# EAGLE design o_clone_rev_f (EAGLE 9.6.0)
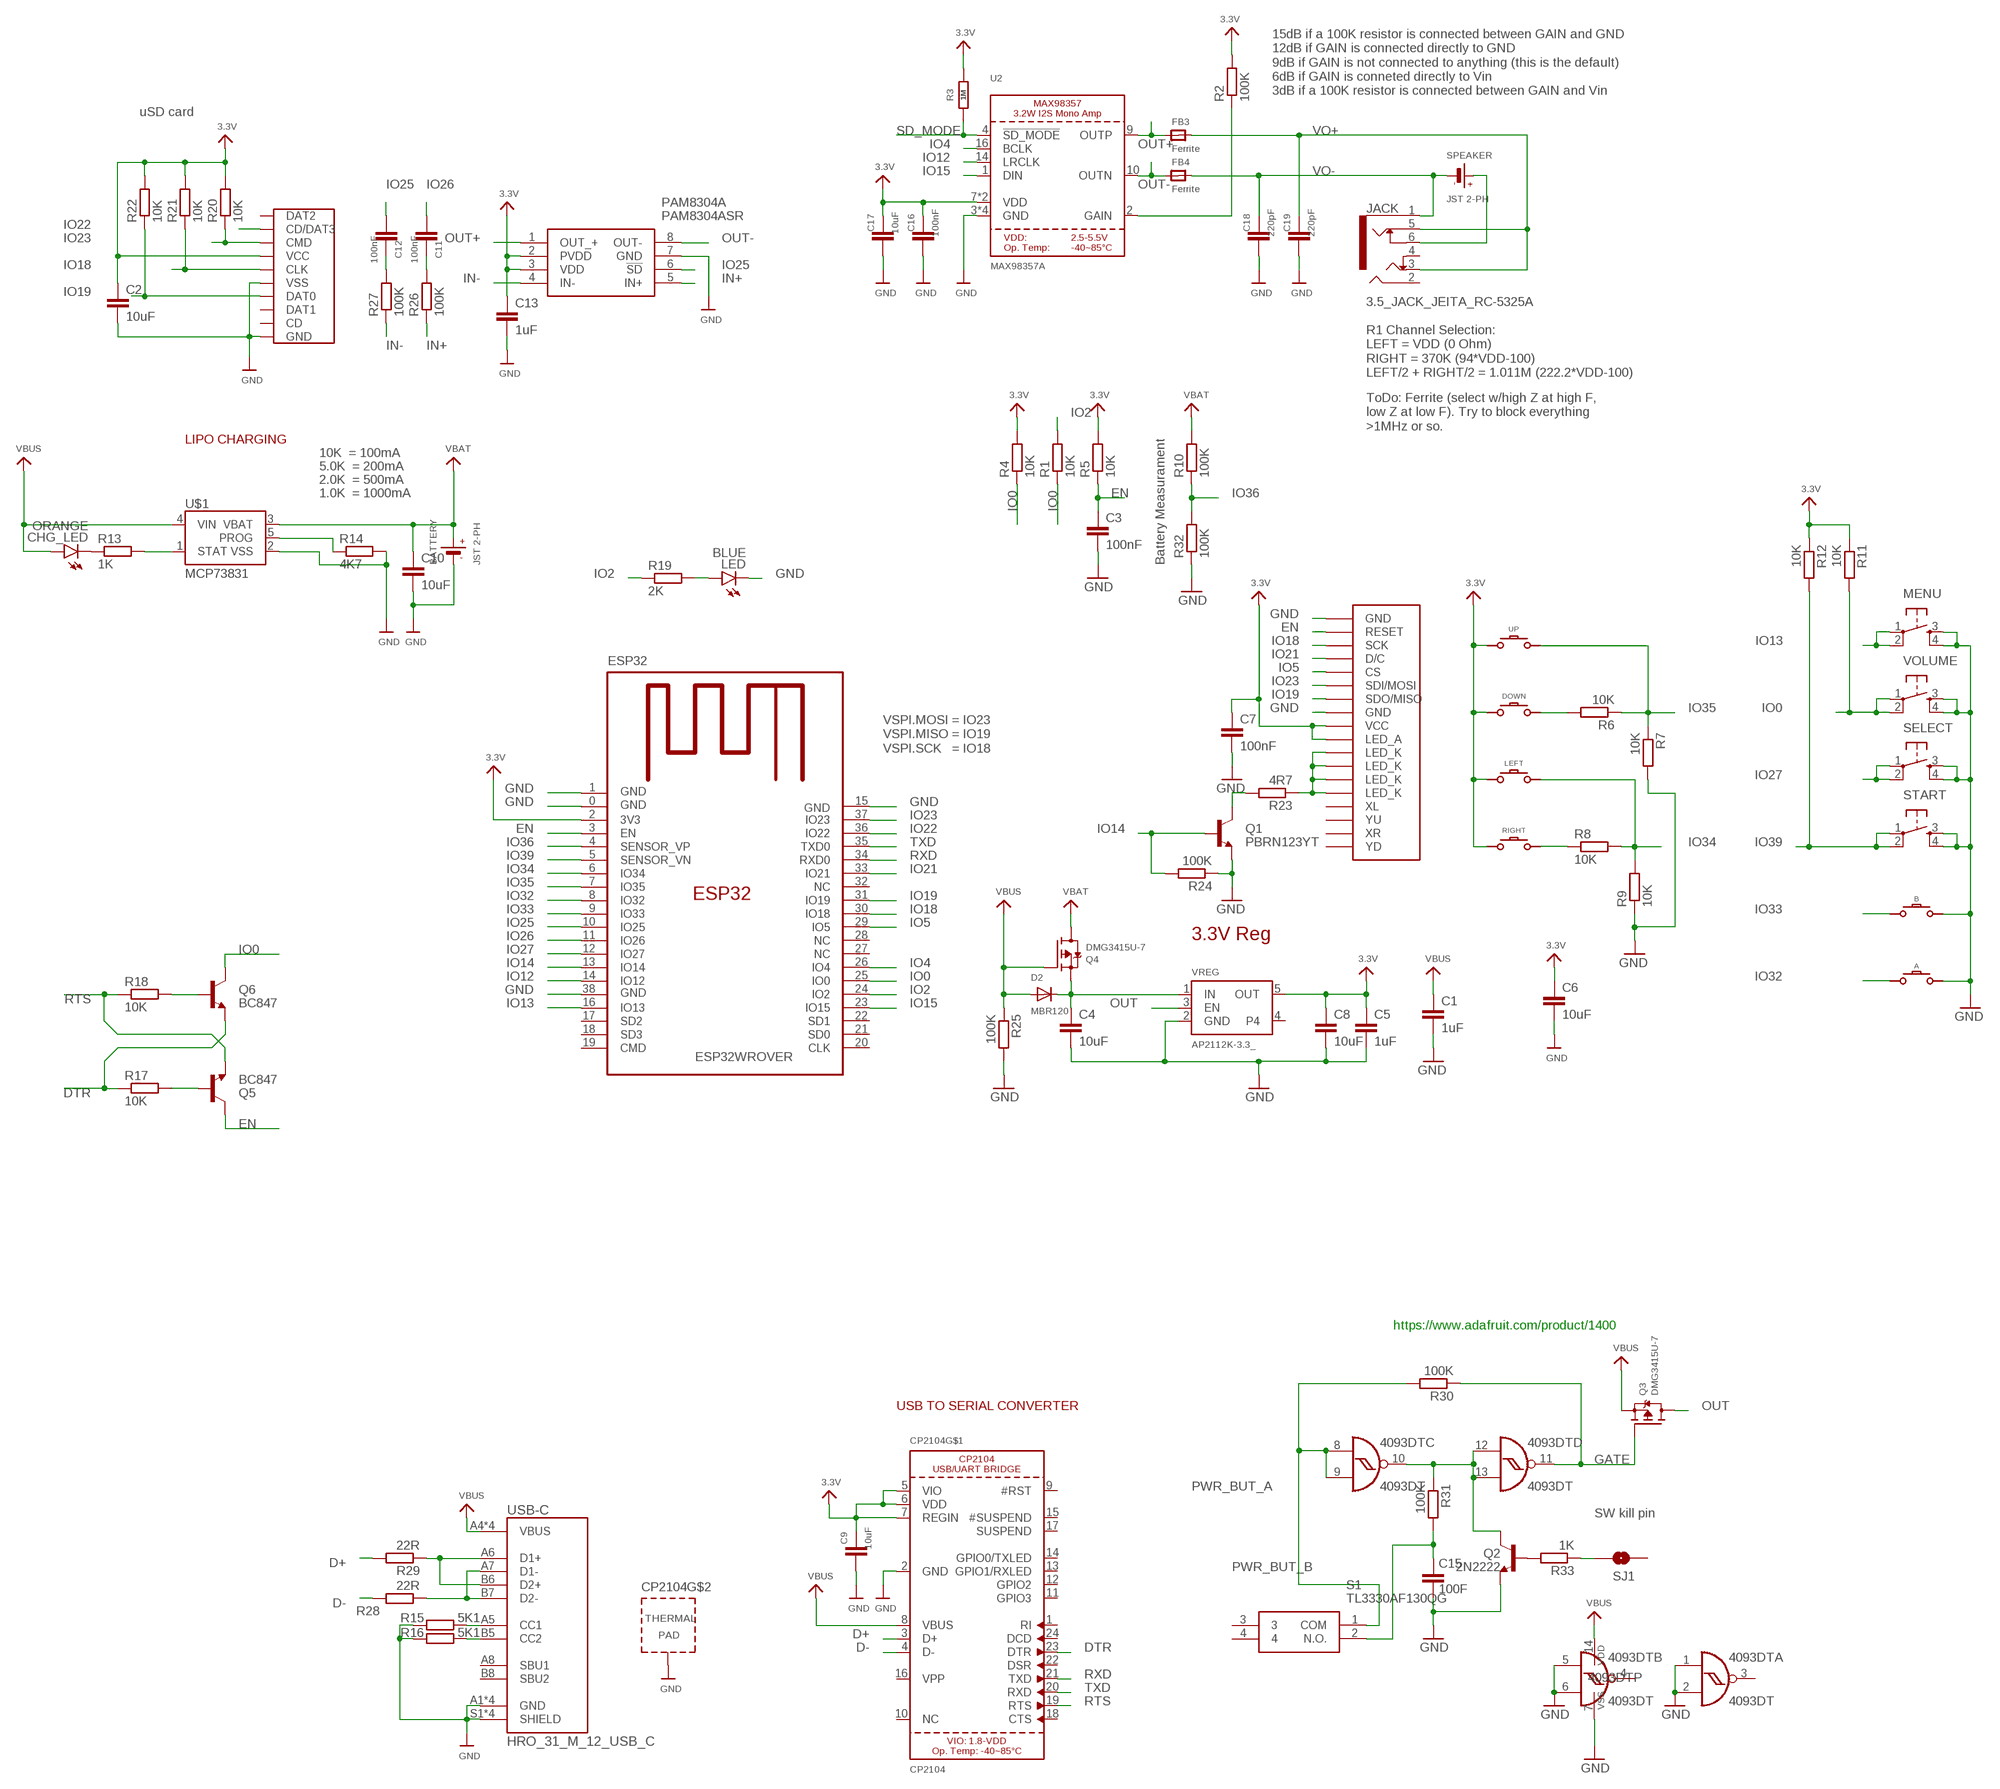
[diagram p0: schematic, sheet 1]

## Parts
4093DT  4093DT  [MC14093B-TSSOP14]
A  CONDUCTIVE_BUTTONCONDUCTIVE_BUTTON_THICK  [CONDUCTIVE_BUTTON_THICK]
B  CONDUCTIVE_BUTTONCONDUCTIVE_BUTTON_THICK  [CONDUCTIVE_BUTTON_THICK]
BATTERY  JST 2-PH  JST_CONNECTOR  [JSTPH2]
C1  1uF  C-EUC0805  [C0805]
C2  10uF  C-EUC0805  [C0805]
C3  100nF  C-EUC0805  [C0805]
C4  10uF  C-EUC0805  [C0805]
C5  1uF  C-EUC0805  [C0805]
C6  10uF  C-EUC0805  [C0805]
C7  100nF  C-EUC0805  [C0805]
C8  10uF  C-EUC0805  [C0805]
C9  10uF  C-EUC0805  [C0805]
C10  10uF  C-EUC0805  [C0805]
C11  100nF  C-EUC0805  [C0805]
C12  100nF  C-EUC0805  [C0805]
C13  1uF  C-EUC0805  [C0805]
C15  100F  C-EUC0805  [C0805]
C16  100nF  C-EUC0805  [C0805]
C17  10uF  C-EUC0805  [C0805]
C18  220pF  C-EUC0805  [C0805]
C19  220pF  C-EUC0805  [C0805]
CHG_LED  ORANGE  LEDCHIPLED_0805  [CHIPLED_0805]
CP2104  CP2104  [QFN24_4MM_SMSC]
D2  MBR120  DIODESOD-123  [SOD-123]
DOWN  CONDUCTIVE_BUTTONCONDUCTIVE_BUTTON_DIRECTIONAL_THICK  [CONDUCTIVE_BUTTON_DIRECTIONAL_THICK]
ESP32  ESP32WROVER  [ESP32WROVER]
FB3  Ferrite  FERRITE0805  [0805]
FB4  Ferrite  FERRITE0805  [0805]
JACK  3.5_JACK_JEITA_RC-5325A  [3.5_JACK_JEITA_RC-5325A]
LCD  ILI9341_3.2LCD_  [LI9341_3.2LCD]
LED  BLUE  LEDCHIPLED_0805  [CHIPLED_0805]
LEFT  CONDUCTIVE_BUTTONCONDUCTIVE_BUTTON_DIRECTIONAL_THICK  [CONDUCTIVE_BUTTON_DIRECTIONAL_THICK]
MENU  TACTILE_SWITCHE_5X5_MICRO"  [TACTILE_SWITCH_5X5_MICRO]
PAM8304A  PAM8304ASR  [SOP65P490X110-8N]
Q1  PBRN123YT  TRANSISTOR_NPNSOT23-3  [SOT23-3]
Q2  2N2222  MMBT2222ALT1-NPN-SOT23-BEC  [SOT23-BEC]
Q3  DMG3415U-7  MOSFET-PWIDE  [SOT23-WIDE@1]
Q4  DMG3415U-7  MOSFET-P  [SOT23-R]
Q5  BC847  TRANSISTOR_NPNSOT23-3  [SOT23-3]
Q6  BC847  TRANSISTOR_NPNSOT23-3  [SOT23-3]
R1  10K  R-EU_R0805  [R0805]
R2  100K  R-EU_R0805  [R0805]
R3  1M  R-EU_R0805  [R0805]
R4  10K  R-EU_R0805  [R0805]
R5  10K  R-EU_R0805  [R0805]
R6  10K  R-EU_R0805  [R0805]
R7  10K  R-EU_R0805  [R0805]
R8  10K  R-EU_R0805  [R0805]
R9  10K  R-EU_R0805  [R0805]
R10  100K  R-EU_R0805  [R0805]
R11  10K  R-EU_R0805  [R0805]
R12  10K  R-EU_R0805  [R0805]
R13  1K  R-EU_R0805  [R0805]
R14  4K7  R-EU_R0805  [R0805]
R15  5K1  R-EU_R0805  [R0805]
R16  5K1  R-EU_R0805  [R0805]
R17  10K  R-EU_R0805  [R0805]
R18  10K  R-EU_R0805  [R0805]
R19  2K  R-EU_R0805  [R0805]
R20  10K  R-EU_R0805  [R0805]
R21  10K  R-EU_R0805  [R0805]
R22  10K  R-EU_R0805  [R0805]
R23  4R7  R-EU_R0805  [R0805]
R24  100K  R-EU_R0805  [R0805]
R25  100K  R-EU_R0805  [R0805]
R26  100K  R-EU_R0805  [R0805]
R27  100K  R-EU_R0805  [R0805]
R28  22R  R-EU_R0805  [R0805]
R29  22R  R-EU_R0805  [R0805]
R30  100K  R-EU_R0805  [R0805]
R31  100K  R-EU_R0805  [R0805]
R32  100K  R-EU_R0805  [R0805]
R33  1K  R-EU_R0805  [R0805]
RIGHT  CONDUCTIVE_BUTTONCONDUCTIVE_BUTTON_DIRECTIONAL_THICK  [CONDUCTIVE_BUTTON_DIRECTIONAL_THICK]
S1  TL3330AF130QG  [TL3330AF130QG]
SD_CARD  MICRO_SD_CARD"  [TFP09-2--12B]
SELECT  TACTILE_SWITCHE_5X5_MICRO"  [TACTILE_SWITCH_5X5_MICRO]
SJ1  SOLDERJUMPERNO  [SJ_2S-NO]
SPEAKER  JST 2-PH  JST_CONNECTOR  [JSTPH2]
START  TACTILE_SWITCHE_5X5_MICRO"  [TACTILE_SWITCH_5X5_MICRO]
U2  MAX98357A  AUDIOAMP_MAX98357  [QFN16_3MM]
U$1  MCP73831  [SOT95P290X120-5]
UP  CONDUCTIVE_BUTTONCONDUCTIVE_BUTTON_DIRECTIONAL_THICK  [CONDUCTIVE_BUTTON_DIRECTIONAL_THICK]
USB-C  HRO_31_M_12_USB_C  [HRO_31_M_12_USB_C]
VOLUME  TACTILE_SWITCHE_5X5_MICRO"  [TACTILE_SWITCH_5X5_MICRO]
VREG  AP2112K-3.3_  [SOT95P290X120-5]

## Nets
3.3V: C2.1 C5.1 C6.1 C7.1 C8.1 C9.1 C13.1 C16.1 C17.1 CP2104.5(VIO) CP2104.6(VDD) CP2104.7(REGIN) DOWN.P$GND ESP32.2(3V3) LCD.P$9(VCC) LCD.P$10(LED_A) LEFT.P$GND PAM8304A.2(PVDD) PAM8304A.3(VDD) R2.2 R3.2 R4.2 R5.2 R11.1 R12.1 R20.2 R21.2 R22.2 RIGHT.P$GND SD_CARD.VCC U2.7(VDD) U2.8(VDD) UP.P$GND VREG.5(OUT)
D+: CP2104.3(D+) R29.2
D-: CP2104.4(D-) R28.2
DTR: CP2104.23(DTR) Q6.2(E) R17.1
EN: C3.1 ESP32.3(EN) LCD.P$2(RESET) Q5.3(C) R5.1
GATE: 4093DT.11(D:O) Q3.1(G) R30.1
GND: 4093DT.1(A:I0) 4093DT.2(A:I1) 4093DT.5(B:I0) 4093DT.6(B:I1) 4093DT.7(P:VSS) A.P$ACTIVE B.P$ACTIVE BATTERY.1(-) C1.2 C2.2 C3.2 C4.2 C5.2 C6.2 C7.2 C8.2 C9.2 C10.2 C13.2 C15.2 C16.2 C17.2 C18.2 C19.2 CP2104.2(GND) CP2104.THERM(TP) ESP32.0(GND) ESP32.1(GND) ESP32.15(GND) ESP32.38(GND) LCD.P$1(GND) LCD.P$8(GND) LED.C MENU.3 MENU.4 PAM8304A.7(GND) Q1.2(E) Q2.E R7.2 R9.1 R14.2 R15.2 R16.2 R24.1 R25.2 R32.1 SD_CARD.GND SD_CARD.GND@1(GND) SD_CARD.GND@2(GND) SD_CARD.GND@3(VSS) SD_CARD.VSS(GND) SELECT.3 SELECT.4 START.3 START.4 U2.3(GND) U2.11(GND) U2.15(GND) U2.THERMAL(GND) U$1.2(VSS) USB-C.A1(GND) USB-C.A12(GND) USB-C.B1(GND) USB-C.B12(GND) USB-C.S1(SHIELD) USB-C.S2(SHIELD) USB-C.S3(SHIELD) USB-C.S4(SHIELD) VOLUME.3 VOLUME.4 VREG.2(GND)
IN+: PAM8304A.5(IN+) R26.1
IN-: PAM8304A.4(IN-) R27.1
IO0: ESP32.25(IO0) Q6.3(C) R1.1 R4.1 R11.2 VOLUME.1 VOLUME.2
IO2: ESP32.24(IO2) R1.2 R19.1
IO4: ESP32.26(IO4) U2.16(BCLK)
IO5: ESP32.29(IO5) LCD.P$5(CS)
IO12: ESP32.14(IO12) U2.14(LRCLK)
IO13: ESP32.16(IO13) MENU.1 MENU.2
IO14: ESP32.13(IO14) Q1.1(B) R24.2
IO15: ESP32.23(IO15) U2.1(DIN)
IO18: ESP32.30(IO18) LCD.P$3(SCK) R21.1 SD_CARD.CLK
IO19: ESP32.31(IO19) LCD.P$7(SDO/MISO) R22.1 SD_CARD.DAT0
IO21: ESP32.33(IO21) LCD.P$4(D/C)
IO22: ESP32.36(IO22) SD_CARD.CD/DAT3
IO23: ESP32.37(IO23) LCD.P$6(SDI/MOSI) R20.1 SD_CARD.CMD
IO25: C12.2 ESP32.10(IO25) PAM8304A.6(!SD)
IO26: C11.2 ESP32.11(IO26)
IO27: ESP32.12(IO27) SELECT.1 SELECT.2
IO32: A.P$GND ESP32.8(IO32)
IO33: B.P$GND ESP32.9(IO33)
IO34: ESP32.6(IO34) LEFT.P$ACTIVE R8.2 R9.2
IO35: ESP32.7(IO35) R6.1 R7.1 UP.P$ACTIVE
IO36: ESP32.4(SENSOR_VP) R10.1 R32.2
IO39: ESP32.5(SENSOR_VN) R12.2 START.1 START.2
N$1: C4.1 D2.C Q4.2(S) VREG.1(IN)
N$2: R8.1 RIGHT.P$ACTIVE
N$3: R15.1 USB-C.A5(CC1)
N$4: DOWN.P$ACTIVE R6.2
N$5: Q1.3(C) R23.2
N$6: LED.A R19.2
N$7: R2.1 U2.2(GAIN)
N$8: R33.1 SJ1.2
N$9: R29.1 USB-C.A6(D1+) USB-C.B6(D2+)
N$10: R28.1 USB-C.A7(D1-) USB-C.B7(D2-)
N$11: R16.1 USB-C.B5(CC2)
N$12: C11.1 R26.2
N$14: JACK.6 SPEAKER.2(+)
N$18: LCD.P$11(LED_K) LCD.P$12(LED_K) LCD.P$13(LED_K) LCD.P$14(LED_K) R23.1
N$19: CHG_LED.C R13.1
N$20: C12.1 R27.2
N$25: Q5.1(B) R17.2
N$26: Q6.1(B) R18.2
N$27: R13.2 U$1.1(STAT)
N$28: R14.1 U$1.5(PROG)
N$56: 4093DT.10(C:O) 4093DT.12(D:I0) 4093DT.13(D:I1) Q2.C R31.1
N$61: Q2.B R33.2
OUT: Q3.3(D) VREG.3(EN)
OUT+: FB3.1 PAM8304A.1(OUT_+) U2.9(OUTP)
OUT-: FB4.1 PAM8304A.8(OUT-) U2.10(OUTN)
PWR_BUT_A: 4093DT.8(C:I0) 4093DT.9(C:I1) R30.2 S1.1(COM)
PWR_BUT_B: C15.1 R31.2 S1.2(N.O.)
RTS: CP2104.19(RTS) Q5.2(E) R18.1
RXD: CP2104.21(TXD) ESP32.34(RXD0)
SD_MODE: R3.1 U2.4(!SD_MODE)
TXD: CP2104.20(RXD) ESP32.35(TXD0)
VBAT: BATTERY.2(+) C10.1 Q4.3(D) R10.2 U$1.3(VBAT)
VBUS: 4093DT.14(P:VDD) C1.1 CHG_LED.A CP2104.8(VBUS) D2.A Q3.2(S) Q4.1(G) R25.1 U$1.4(VIN) USB-C.A4(VBUS) USB-C.A9(VBUS) USB-C.B4(VBUS) USB-C.B9(VBUS)
VO+: C19.1 FB3.2 JACK.3 JACK.5
VO-: C18.1 FB4.2 JACK.1 SPEAKER.1(-)
Unconnected: 4093DT.3(A:O) 4093DT.4(B:O) CP2104.1(RI) CP2104.9(#RST) CP2104.10(NC) CP2104.11(GPIO3) CP2104.12(GPIO2) CP2104.13(GPIO1/RXLED) CP2104.14(GPIO0/TXLED) CP2104.15(#SUSPEND) CP2104.16(VPP) CP2104.17(SUSPEND) CP2104.18(CTS) CP2104.22(DSR) CP2104.24(DCD) ESP32.17(SD2) ESP32.18(SD3) ESP32.19(CMD) ESP32.20(CLK) ESP32.21(SD0) ESP32.22(SD1) ESP32.27(NC) ESP32.28(NC) ESP32.32(NC) JACK.2 JACK.4 LCD.P$15(XL) LCD.P$16(XR) LCD.P$17(YD) LCD.P$18(YU) S1.3 S1.4 SD_CARD.CD SD_CARD.DAT1 SD_CARD.DAT2 SJ1.1 USB-C.A8(SBU1) USB-C.B8(SBU2) VREG.4

## Notes on the sheet
- 15dB if a 100K resistor is connected between GAIN and GND
  12dB if GAIN is connected directly to GND
  9dB if GAIN is not connected to anything (this is the default)
  6dB if GAIN is conneted directly to Vin
  3dB if a 100K resistor is connected between GAIN and Vin
- uSD card
- R1 Channel Selection:
  LEFT = VDD (0 Ohm)
  RIGHT = 370K (94*VDD-100)
  LEFT/2 + RIGHT/2 = 1.011M (222.2*VDD-100)
- ToDo: Ferrite (select w/high Z at high F,
  low Z at low F). Try to block everything
  >1MHz or so.
- LIPO CHARGING
- 10K  = 100mA
- 5.0K  = 200mA
- 2.0K  = 500mA
- 1.0K  = 1000mA
- Battery Measurament
- VSPI.MOSI = IO23
  VSPI.MISO = IO19
  VSPI.SCK   = IO18
- 3.3V Reg
- https://www.adafruit.com/product/1400
- USB TO SERIAL CONVERTER
- SW kill pin

## Library data of the parts
4093DT = adafruit:4093: Quad 2-input NAND schmitt trigger
A B DOWN LEFT RIGHT UP = 32teeth - Conductive Buttons:CONDUCTIVE_BUTTON
BATTERY SPEAKER = dronecz:JST_CONNECTOR
C1-C13 C15-C19 = rcl:C-EU: CAPACITOR, European symbol; SPICEPREFIX: C
CHG_LED LED = led:LED: LED OSRAM: - CHIPLED LG R971, LG N971, LY N971, LG Q971, LY Q971, LO R971, LY R971 LH N974, LH R974 LS Q976, LO Q976, LY Q976 LO Q996 - Hyper CHIPLED LW Q18S LB Q993, LB Q99A, LB R99A - SideLED LS A670, LO A670, LY A670, LG A670, LP A670 LB A673, LV A673, LT A673, LW A673 LH A674 LY A675 LS A676, LA A676, LO A676, LY A676, LW A676 LS A679, LY A679, LG A679 - Hyper Micro SIDELED® LS Y876, LA Y876, LO Y876, LY Y876 LT Y87S - SmartLED LW L88C, LW L88S LB L89C, LB L89S, LG L890 LS L89K, LO L89K, LY L89K LS L896, LA L896, LO L896, LY L896 - TOPLED LS T670, LO T670, LY T670, LG T670, LP T670 LSG T670, LSP T670, LSY T670, LOP T670, LYG T670 LG T671, LOG T671, LSG T671 LB T673, LV T673, LT T673, LW T673 LH T674 LS T676, LA T676, LO T676, LY T676, LB T676, LH T676, LSB T676, LW T676 LB T67C, LV T67C, LT T67C, LS T67K, LO T67K, LY T67K, LW E67C LS E67B, LA E67B, LO E67B, LY E67B, LB E67C, LV E67C, LT E67C LW T67C LS T679, LY T679, LG T679 LS T770, LO T770, LY T770, LG T770, LP T770 LB T773, LV T773, LT T773, LW T773 LH T774 LS E675, LA E675, LY E675, LS T675 LS T776, LA T776, LO T776, LY T776, LB T776 LHGB T686 LT T68C, LB T68C - Hyper Mini TOPLED® LB M676 - Mini TOPLED Santana® LG M470 LS M47K, LO M47K, LY M47K Source: http://www.osram.convergy.de LUXEON: - LUMILED® LXK2-PW12-R00, LXK2-PW12-S00, LXK2-PW14-U00, LXK2-PW14-V00 LXK2-PM12-R00, LXK2-PM12-S00, LXK2-PM14-U00 LXK2-PE12-Q00, LXK2-PE12-R00, LXK2-PE12-S00, LXK2-PE14-T00, LXK2-PE14-U00 LXK2-PB12-K00, LXK2-PB12-L00, LXK2-PB12-M00, LXK2-PB14-N00, LXK2-PB14-P00, LXK2-PB14-Q00 LXK2-PR12-L00, LXK2-PR12-M00, LXK2-PR14-Q00, LXK2-PR14-R00 LXK2-PD12-Q00, LXK2-PD12-R00, LXK2-PD12-S00 LXK2-PH12-R00, LXK2-PH12-S00 LXK2-PL12-P00, LXK2-PL12-Q00, LXK2-PL12-R00 Source: www.luxeon.com KINGBRIGHT: KA-3528ASYC Source: www.kingbright.com
CP2104 = dronecz:CP2104: CP2104 - USB to UART Bridge VDD Output: 3.45V
D2 = microbuilder:DIODE: Diode SMA Model Volts Amps Type Vf Vr Digikey # Notes SSA34-E3 40V 3A Schottky 480mV @ 3A 200uA @ 40V SSA34-E3/61TGITR-ND CDBA120-G 20V 1A Schottky 500mV @ 1A 500uA @ 20V 641-1014-6-ND REEL MBRA210 10V 2A Schottky 350mV @ 2A 700uA @ 10V MBRA210LT3 SOD-123 Model Volts Amps Type Vf Vr Order # Notes BAT54T1G 30V 200mA Schottky 800mV @ 200mA 2uA @ 25V BAT54T1GOSTR-ND B0530W 30V 500mA Schottky 430mV @ 500mA 130uA @ 30V B0530W-FDICT-ND REEL MBR120 1A 20V Schottky 340mV @ 1A MBR120VLSFT1GOSCT-ND SOD-323 Model Volts Amps Type Vf Vr Order # Notes PMEG2005EJ 20V 500mA Schottky 355mV @ 500mA 568-4110-1-ND ZLLS410 10V 570mA Schottky 380mV @ 570mA ZLLS410CT-ND 1N4148WS 75V 150mA Silicon/Simple 1V 1N4148WSFSCT-ND REEL SOD-523 Model Volts Amps Type Vf Vr Order # Notes BAT54XV2 30V 200mA Schottky 0.8V @ 100mA BAT54XV2CT-ND TB751S 30V 30mA Schottky RB751S-40TE61CT-ND SOT23-R/W (R = Solder Paste/Reflow Ovens, W = Hand-Soldering) Model Volts Amps Type Vf Vr Order # Notes BAT54FILM 40V 300mA Schottky 497-7162-1-ND
ESP32 = dronecz:ESP32WROVER
FB3 FB4 = microbuilder:FERRITE: Ferrite Bead 0603 MMZ1608B121C - 120 Ohm @ 100MHz, 600mA, 0.15 Ohm DC Resistance - Digikey: 445-2164-1-ND BK1608HW121-T - 120 Ohm, 600mA Ferrite Chip - Digikey: 587-1876-2-ND 0805 HZ0805B272R-10 - 2.7K Ohm @ 100MHz, 200mA, 0.8 Ohm DC Resistance - Digikey: 240-2504-1-ND (see also Murata BLM21BD272SN1L) MMZ2012Y152B - 1.5K Ohm @ 100MHz, 500mA, 0.4 Ohm DC Resistance - Digikey: 445-1560-1-ND - Mainly for high frequency (80-400MHz) MMZ2012R102A - 1K Ohm @ 100MHz, 500mA, 0.3 Ohm DC Resistance - Digikey: 445-1555-2-ND - More general purpose (10-200MHz)
JACK = dronecz:3.5_JACK_JEITA_RC-5325A: https://www.lumberg.com/en/products/product/1503+21#downloads
LCD = dronecz:ILI9341_3.2LCD
MENU SELECT START VOLUME = dronecz:TACTILE_SWITCHE_5X5_MICRO
PAM8304A = SamacSys_Parts:PAM8304ASR: PAM8304ASR DiodesZetex, Audio Amplifier, 8-Pin MSOP Mono Source: Datasheet <https://componentsearchengine.com/Datasheets/1/PAM8304ASR.pdf>; DESCRIPTION: PAM8304ASR DiodesZetex, Audio Amplifier, 8-Pin MSOP Mono; HEIGHT: 1.1mm; MANUFACTURER_NAME: Diodes Inc.; MANUFACTURER_PART_NUMBER: PAM8304ASR; MOUSER_PART_NUMBER: 621-PAM8304ASR
Q1 Q5 Q6 = SparkFun:TRANSISTOR_NPN: Transistor NPN BJT configuration in SOT23 package. MMBT2222 is the common NPN we use. Double check BCE configuration again layout.
Q2 = transistor:*-NPN-: NPN Transistror BF959 corrected 2008.03.06
Q3 Q4 = microbuilder:MOSFET-P: P-Channel Mosfet LEGEND VDS: Voltage Drain-Source ID: Drain Current RDS(ON): Drain-Source On-State Resistance VGS(TH): Gate-Source Threshold Voltage CISS: Drain-Source Input Capacitance SOT-23 Name VDS ID RDS(ON) VGS(TH) CISS Order Number IRLML5103 30V 760mA 600 mOhm -- 75pF @ 25V Digikey: IRLML5103PBFCT-ND IRLML6401 12V 4.3A 50 mOhm 950mV @ 250µA 830pF @ 10V Digikey: IRLML6401PBFTR-ND NTR0202PL 20V 400mA 800 mOhm 2.3V @ 250uA 70pF @ 5V Digikey: NTR0202PLT1GOSTR-ND NTR4101PT1G 20V 1.8A 85 mOhm 1.2V @ 250uA 675pF @ 10V Digikey: NTR4101PT1GOSCT-ND DMP2004K 20V 600mA 900 mOhm 1V @ 250uA 175pF @ 16V Digikey: DMP2004KDICT-ND PMV65XP 20V 3.9A 76 mOhm 950mV @ 1mA 725pF @ 20V Digikey: 568-2358-2-ND TO-252 Name VDS ID RDS(ON) VGS(TH) CISS Order Number AOD417 30V 25A 34 mOhm 3V @ 250µA 920pF @ 15V Digikey: 785-1106-2-ND
R1-R33 = rcl:R-EU_: RESISTOR, European symbol; SPICEPREFIX: R
S1 = SamacSys_Parts:TL3330AF130QG: E-SWITCH - TL3330AF130QG - SWITCH, TACTILE, SPST, 50mA, 12VDC Source: Datasheet <https://componentsearchengine.com/Datasheets/1/TL3330AF130QG.pdf>; DESCRIPTION: E-SWITCH - TL3330AF130QG - SWITCH, TACTILE, SPST, 50mA, 12VDC; HEIGHT: 3.4mm; MANUFACTURER_NAME: E-Switch; MANUFACTURER_PART_NUMBER: TL3330AF130QG; MOUSER_PART_NUMBER: 612-TL3330AF130QG; MOUSER_PRICE-STOCK: https://www.mouser.com/Search/Refine.aspx?Keyword=612-TL3330AF130QG
SD_CARD = dronecz:MICRO_SD_CARD
SJ1 = SparkFun:SOLDERJUMPER: Solder Jumper Standard SMD solder jumper. Used to automate production. Two varients : Normally Open and Normally Closed are the same, but have different paste layers. NC will have a large amount of paste and should jumper during reflow.
U2 = microbuilder:AUDIOAMP_MAX98357: MAX98357 - 3.2W I2S Mono Audio Amp
U$1 = dronecz:MCP73831
USB-C = dronecz:HRO_31_M_12_USB_C: USB Shielded I/O Receptacle; Type C; Right Angle; Surface Mount; Gold over Nickel
VREG = dronecz:AP2112K-3.3

## Board
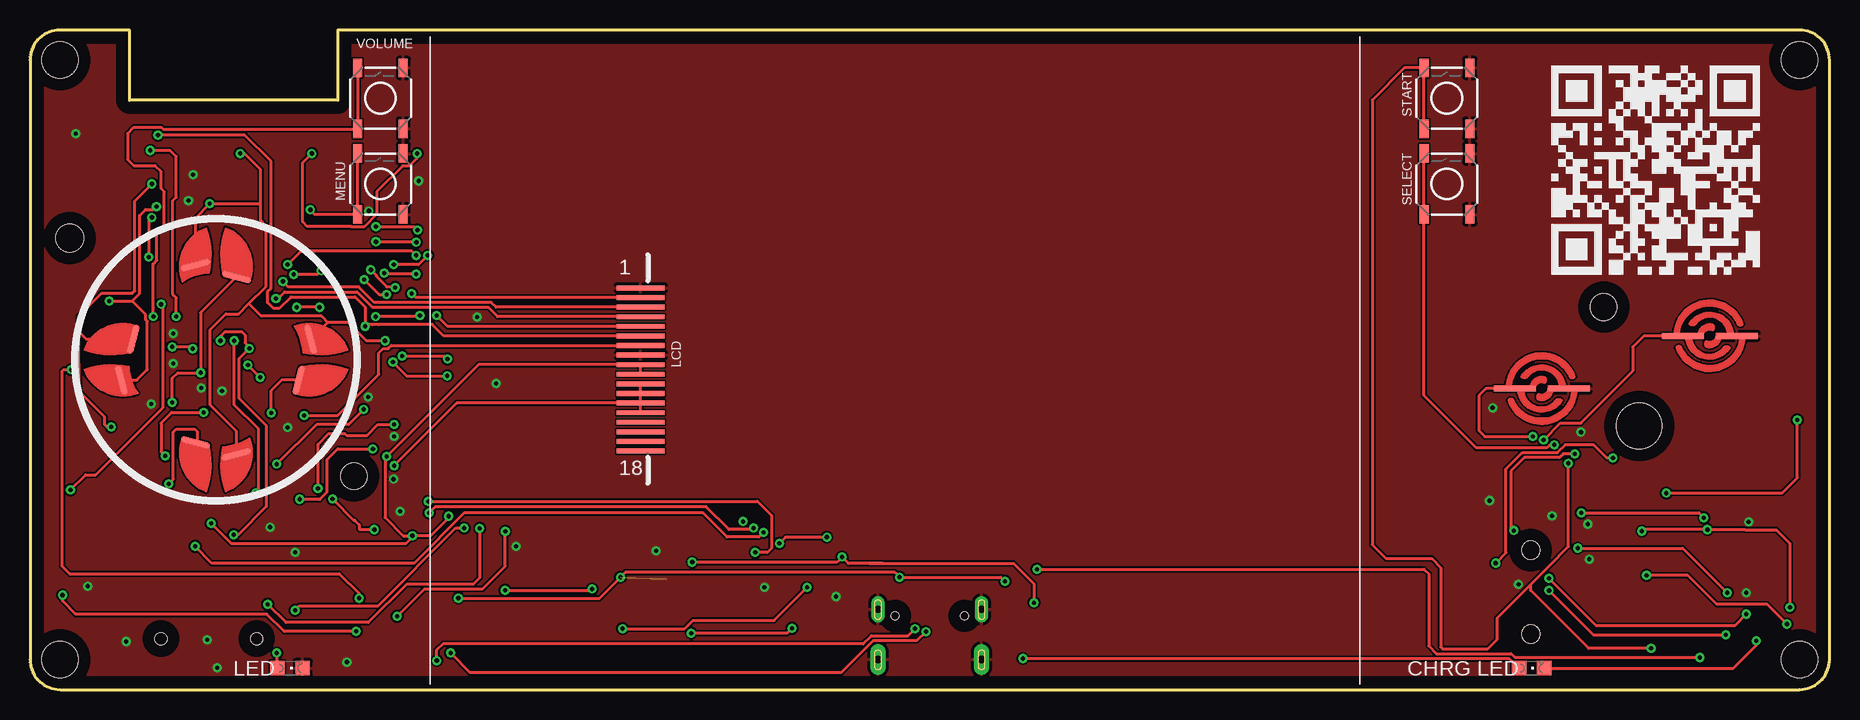
[diagram p1: board, top side]
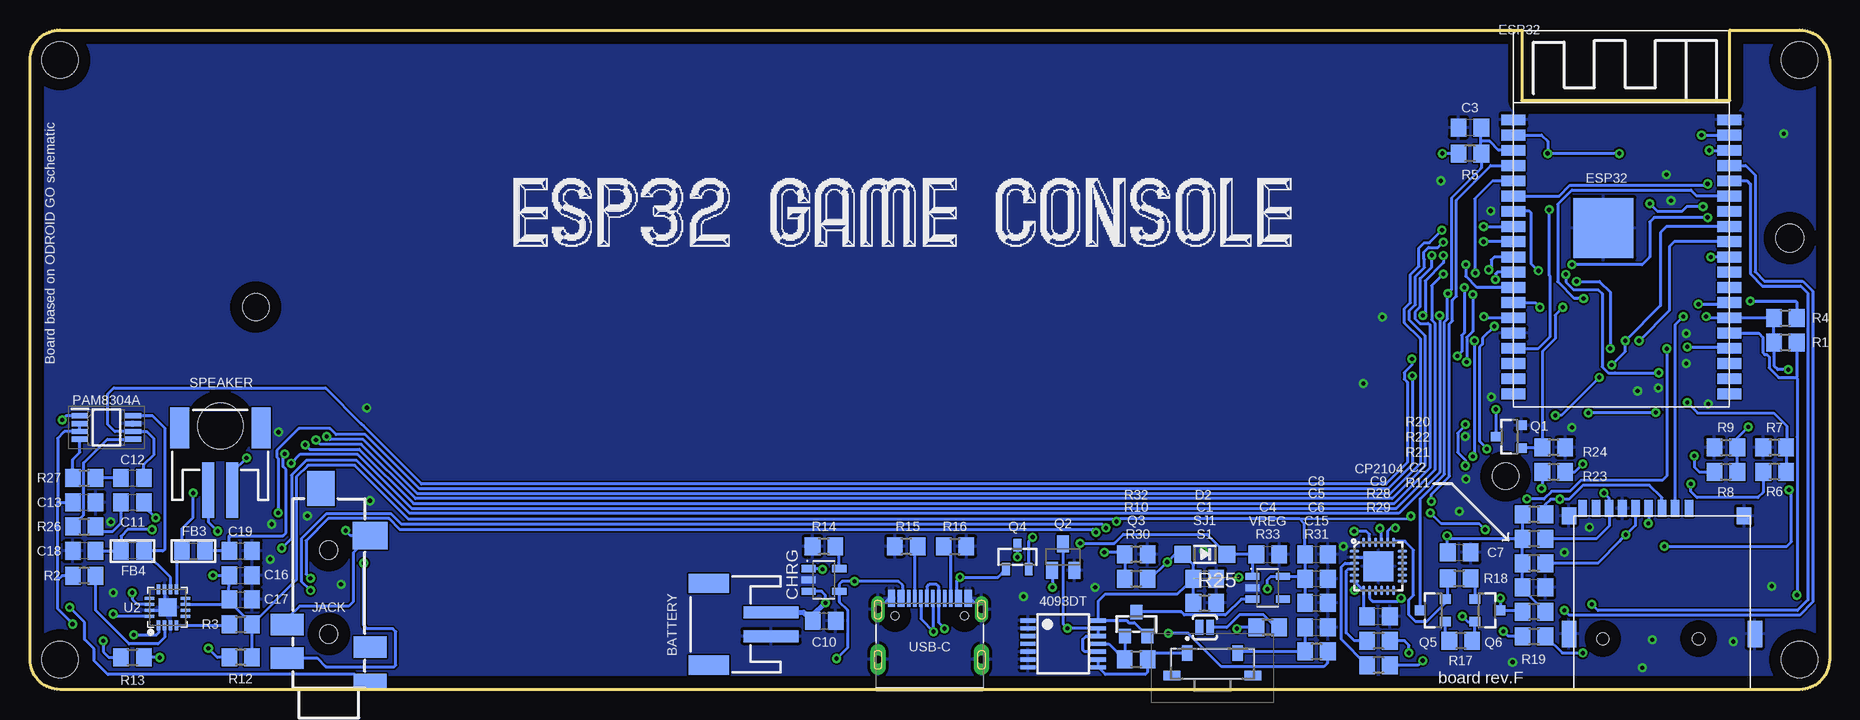
[diagram p2: board, bottom side, seen from below]

Size 150 x 55 mm. Coordinates in mm from the lower left corner, seen from the top.
Outline: 8.3,49.13 8.3,55 2.5,55 arc90 0,52.5 0,2.5 arc90 2.5,0 147.5,0 arc90 150,2.5 150,52.5 arc90 147.5,55 25.66,55 25.66,49.13 8.3,49.13
Copper layers (1*16): Top 0.035mm / dielectric 1.5mm / Bottom 0.035mm
Design rules "default": minimum track width 6mil, minimum drill 0.35mm, track to track 6mil, track to pad 6mil, pad to pad 6mil, via to via 6mil, smd to smd 6mil, copper to edge 40mil, drill to drill 6mil, minimum pad ring 10mil, minimum via ring 8mil, stop-mask expansion 4mil, vias tented up to drill 0mil, thermal gap 10mil
Holes 2.2 mm at 131.18,31.9 27,17.8
Holes 3.8 mm at 134.13,21.99
Holes 3 mm at 2.5,52.5 2.5,2.5 147.5,2.5 147.5,52.5
Holes 2.3 mm at 3.3,37.65

### Footprints (pad centres in the part's own frame; a part is rotated, then mirrored left to right if it is on the bottom)
MC14093B-TSSOP14 = smd 0.36 x 1.26: 1 -1.95,-2.925; 2 -1.3,-2.925; 3 -0.65,-2.925; 4 0,-2.925; 5 0.65,-2.925; 6 1.3,-2.925; 7 1.95,-2.925; 8 1.95,2.925; 9 1.3,2.925; 10 0.65,2.925; 11 0,2.925; 12 -0.65,2.925; 13 -1.3,2.925; 14 -1.95,2.925
CONDUCTIVE_BUTTON_THICK = smd 0.5 x 3.5: P$ACTIVE 0,-2.25; P$GND 0,2.25
JSTPH2 = smd 1 x 4.6: 1 -1,-3.7; 2 1,-3.7 | smd 1.6 x 3.4: NC1 -3.4,1.5; NC2 3.4,1.5
C0805 = smd 1.3 x 1.5: 1 -0.95,0; 2 0.95,0
CHIPLED_0805 = smd 1.2 x 1.2: A 0,-1.05; C 0,1.05
QFN24_4MM_SMSC = smd 0.8 x 0.28: 1 -2,1.25; 2 -2,0.75; 3 -2,0.25; 4 -2,-0.25; 5 -2,-0.75; 6 -2,-1.25; 13 2,-1.25; 14 2,-0.75; 15 2,-0.25; 16 2,0.25; 17 2,0.75; 18 2,1.25 | smd 0.28 x 0.8: 7 -1.25,-2; 8 -0.75,-2; 9 -0.25,-2; 10 0.25,-2; 11 0.75,-2; 12 1.25,-2; 19 1.25,2; 20 0.75,2; 21 0.25,2; 22 -0.25,2; 23 -0.75,2; 24 -1.25,2 | smd 2.5 x 2.5: THERM 0,0
SOD-123 = smd 1.4 x 1.4: A 1.85,0; C -1.85,0
CONDUCTIVE_BUTTON_DIRECTIONAL_THICK = smd 2.5 x 0.5 rotated 75: P$ACTIVE 1.1,1.7 | smd 2.5 x 0.5 rotated 285: P$GND 0.1,-1.7
ESP32WROVER = smd 5 x 5: 0 -1.5,-0.75 | smd 2 x 0.9: 1 -9,8.26; 2 -9,6.99; 3 -9,5.72; 4 -9,4.45; 5 -9,3.18; 6 -9,1.91; 7 -9,0.64; 8 -9,-0.63; 9 -9,-1.9; 10 -9,-3.17; 11 -9,-4.44; 12 -9,-5.71; 13 -9,-6.98; 14 -9,-8.25; 15 -9,-9.52; 16 -9,-10.79; 17 -9,-12.06; 18 -9,-13.33; 19 -9,-14.6; 20 9,-14.6; 21 9,-13.33; 22 9,-12.06; 23 9,-10.79; 24 9,-9.52; 25 9,-8.25; 26 9,-6.98; 27 9,-5.71; 28 9,-4.44; 29 9,-3.17; 30 9,-1.9; 31 9,-0.63; 32 9,0.64; 33 9,1.91; 34 9,3.18; 35 9,4.45; 36 9,5.72; 37 9,6.99; 38 9,8.26
0805 = smd 1.3 x 1.5: 1 -0.95,0; 2 0.95,0
3.5_JACK_JEITA_RC-5325A = smd 1.2 x 2.75: 1 0.6,-3.45 | smd 1.8 x 2.75: 2 3.4,-3.45; 5 5.3,3.45; 6 2.5,3.45 | smd 2.3 x 2.9: 3 12.7,-3.45 | smd 2.9 x 2.3: 4 16.65,0.65 | hole 1.5: 4.5,0; 11.5,0
LI9341_3.2LCD = smd 4 x 0.4: P$1 -24.089,6.127; P$2 -24.089,5.327; P$3 -24.089,4.527; P$4 -24.089,3.727; P$5 -24.089,2.927; P$6 -24.089,2.127; P$7 -24.089,1.327; P$8 -24.089,0.527; P$9 -24.089,-0.273; P$10 -24.089,-1.073; P$11 -24.089,-1.873; P$12 -24.089,-2.673; P$13 -24.089,-3.473; P$14 -24.089,-4.273; P$15 -24.089,-5.073; P$16 -24.089,-5.873; P$17 -24.089,-6.673; P$18 -24.089,-7.473
TACTILE_SWITCH_5X5_MICRO = smd 1.524 x 0.762: 1 -2.54,1.905; 2 2.54,1.905; 3 -2.54,-1.905; 4 2.54,-1.905
SOP65P490X110-8N = smd 1.4 x 0.45: 1 -2.2,0.975; 2 -2.2,0.325; 3 -2.2,-0.325; 4 -2.2,-0.975; 5 2.2,-0.975; 6 2.2,-0.325; 7 2.2,0.325; 8 2.2,0.975
SOT23-3 = smd 0.8 x 0.9: 1 -0.95,-1; 2 0.95,-1; 3 0,1.1
SOT23-BEC = smd 1 x 1.4: B -0.95,-1.1; C 0,1.1; E 0.95,-1.1
SOT23-WIDE@1 = smd 1 x 1.2: 1 -0.95,-1; 2 0.95,-1; 3 0,1
SOT23-R = smd 0.635 x 1.016: 1 -0.95,-1; 2 0.95,-1; 3 0,1
R0805 = smd 1.3 x 1.5: 1 -0.95,0; 2 0.95,0
TL3330AF130QG = smd 0.9 x 1.27: 1 -2.1,1.385; 2 2.1,1.385 | smd 1.45 x 0.8: 3 -3.375,-0.5; 4 3.375,-0.5
TFP09-2--12B = smd 0.711 x 1.422: CD -6.6,7.85; CD/DAT3 1.1,7.85; CLK -2.2,7.85; CMD 0,7.85; DAT0 -4.4,7.85; DAT1 -5.5,7.85; DAT2 2.25,7.85; VCC -1.1,7.85; VSS -3.3,7.85 | smd 1.2 x 2.2: GND -7.75,-2.6; GND@1 7.75,-2.6 | smd 1.2 x 1.4: GND@2 -7.75,7.25; GND@3 6.85,7.25 | hole 1: -4.93,-3; 3.05,-3
SJ_2S-NO = smd 0.635 x 1.27: 1 -0.45,0; 2 0.45,0
QFN16_3MM = smd 0.8 x 0.28: 1 -1.5,0.75; 2 -1.5,0.25; 3 -1.5,-0.25; 4 -1.5,-0.75; 9 1.5,-0.75; 10 1.5,-0.25; 11 1.5,0.25; 12 1.5,0.75 | smd 0.28 x 0.8: 5 -0.75,-1.5; 6 -0.25,-1.5; 7 0.25,-1.5; 8 0.75,-1.5; 13 0.75,1.5; 14 0.25,1.5; 15 -0.25,1.5; 16 -0.75,1.5 | smd 1.5 x 1.5: THERMAL 0,0
SOT95P290X120-5 = smd 1.18 x 0.609: 1 -1.274,0.95; 2 -1.274,0; 3 -1.274,-0.95; 4 1.274,-0.95; 5 1.274,0.95
HRO_31_M_12_USB_C = smd 0.3 x 1.45: A1 -3.35,4.045; A4 -2.55,4.045; A5 -1.25,4.045; A6 -0.25,4.045; A7 0.25,4.045; A8 1.25,4.045; A9 2.55,4.045; A12 3.35,4.045; B1 3.05,4.045; B4 2.25,4.045; B5 1.75,4.045; B6 0.75,4.045; B7 -0.75,4.045; B8 -1.75,4.045; B9 -2.25,4.045; B12 -3.05,4.045 | drill 0.6 pad 1.1 long: S1 -4.32,3.13; S2 4.32,3.13 | drill 0.6 pad 1.3 long: S3 -4.32,-1.05; S4 4.32,-1.05 | hole 0.65: -2.89,2.6; 2.89,2.6

### Placement (x,y rotation side)
4093DT  63.88,3.81 270 bottom
A  126,25.1 90 top
B  140,29.5 90 top
BATTERY  91.92,5.45 90 bottom
C1  52.07,9.24 0 bottom
C2  24.64,8.51 0 bottom
C3  29.97,46.86 180 bottom
C4  46.82,11.28 0 bottom
C5  42.76,9.24 0 bottom
C6  42.76,7.21 0 bottom
C7  30.86,11.43 0 bottom
C8  42.76,11.28 0 bottom
C9  37.59,6.1 0 bottom
C10  83.8,5.74 0 bottom
C11  141.46,15.62 0 bottom
C12  141.46,17.65 0 bottom
C13  145.48,15.62 0 bottom
C15  42.76,5.18 0 bottom
C16  132.44,9.54 0 bottom
C17  132.44,7.5 0 bottom
C18  145.48,11.56 180 bottom
C19  132.44,11.56 0 bottom
CHG_LED  125.16,1.78 270 top
CP2104  37.59,10.29 0 bottom
D2  52.07,11.28 180 bottom
DOWN  15.5,19.5 90 top
ESP32  17.34,39.24 0 bottom
FB3  136.38,11.56 0 bottom
FB4  141.46,11.56 180 bottom
JACK  125.09,0.13 90 bottom
LCD  75,27.36 0 top
LED  21.68,1.78 270 top
LEFT  7.5,27.5 0 top
MENU  29.21,42.16 90 top
PAM8304A  143.64,21.84 0 bottom
Q1  26.67,21.08 90 bottom
Q2  63.88,11.05 0 bottom
Q3  57.78,5.46 0 bottom
Q4  67.69,11.05 0 bottom
Q5  33.02,6.6 90 bottom
Q6  28.57,6.6 270 bottom
R1  3.68,28.96 0 bottom
R2  145.48,9.5 180 bottom
R3  132.44,5.44 0 bottom
R4  3.68,30.99 0 bottom
R5  29.97,44.7 180 bottom
R6  4.57,18.16 180 bottom
R7  4.57,20.19 180 bottom
R8  8.64,18.16 0 bottom
R9  8.64,20.19 0 bottom
R10  57.78,9.24 0 bottom
R11  24.64,6.48 180 bottom
R12  132.44,2.68 180 bottom
R13  141.46,2.68 0 bottom
R14  83.82,11.94 180 bottom
R15  76.96,11.94 180 bottom
R16  72.9,11.94 0 bottom
R17  30.73,4.06 180 bottom
R18  30.86,9.27 0 bottom
R19  24.64,4.45 0 bottom
R20  24.64,14.61 180 bottom
R21  24.64,10.54 180 bottom
R22  24.64,12.57 180 bottom
R23  22.99,18.16 0 bottom
R24  22.99,20.19 180 bottom
R25  52.07,7.24 0 bottom
R26  145.48,13.59 0 bottom
R27  145.48,17.65 0 bottom
R28  37.59,4.06 180 bottom
R29  37.59,2.03 180 bottom
R30  57.78,2.54 0 bottom
R31  42.76,3.17 180 bottom
R32  57.78,11.28 180 bottom
R33  46.82,5.18 180 bottom
RIGHT  23.5,27.5 180 top
S1  51.44,1.65 0 bottom
SD_CARD  13.97,7.24 0 bottom
SELECT  118.11,42.16 90 top
SJ1  52.07,5.18 0 bottom
SPEAKER  134.13,20.32 0 bottom
START  118.11,49.3 90 top
U2  138.53,6.86 90 bottom
U$1  83.82,9.14 0 bottom
UP  15.5,35.5 270 top
USB-C  75,3.56 0 bottom
VOLUME  29.21,49.3 90 top
VREG  46.82,8.48 0 bottom

### Tracks (layer width: path | path; a pad name or v marks a point on that pad's centre or on a via)
3.3V  (via drill 0.35)
  Top 0.254: v15.11,13.84 16.76,12.19 31.37,12.19 32,12.83 | v34.91,14.46 34.91,14.33 33.4,12.83 32,12.83 | 32,12.83 v31.88,12.83 31.11,12.83 29.59,14.35 29.59,19.3 v29.72,19.43 37.38,27.09 LCD.P$9 LCD.P$10 | 19.21,40.39 19.21,39.13 19.68,38.66 19.68,33.62 18.24,32.18 | 19.21,40.39 19.21,43.37 17.88,44.7 v17.53,44.7 | 24.82,30.62 26.52,30.62 28.05,29.08 v29.59,29.08 | 18.24,32.18 17.38,31.32 16.33,31.32 14.99,29.97 14.99,23.76 17.2,21.55 DOWN.P$GND | 18.24,32.18 19.29,31.13 24.3,31.13 24.82,30.62 | 19.21,40.39 19.09,40.51 v14.99,40.51 13.8,39.33 UP.P$GND | v6.6,32.38 8.51,32.38 | v10.54,40.28 10.29,40.03 9.63,40.03 9.14,39.54 9.14,33.02 8.51,32.38 | v32.28,44.7 32.28,44.33 31.61,43.66 31.06,43.66 28.9,41.5 28.9,39.64 27.84,38.58 26.81,38.58 26.78,38.61 23.11,38.61 22.71,39.01 22.71,43.92 v23.5,44.7 | LEFT.P$GND 8.91,25.8 9.78,26.67 9.78,30.69 9.63,30.84 9.63,31.27 8.51,32.38 | RIGHT.P$GND 24.82,30.62 | v39.61,8.28 46.76,8.28 v46.86,8.38 | v146.45,5.46 144.8,7.11 140.59,7.11 138.18,9.53 v134.75,9.53
  Bottom 0.254: R22.2 R21.2 C2.1 25.59,8.38 R11.1 | 43.71,9.46 C8.1 43.76,13.81 44.2,14.25 | 43.71,9.46 C5.1 C6.1 | R20.2 R22.2 | SD_CARD.VCC 15.07,13.89 v15.11,13.84 | C7.1 31.88,11.5 v31.88,12.83 31.62,12.57 R22.2 | ESP32.2 24.01,46.23 23.5,45.72 v23.5,44.7 v17.53,44.7 | v6.6,32.38 2.79,32.38 2.73,32.32 R4.2 | v29.59,29.08 29.59,19.56 v29.72,19.43 | 44.2,14.25 59.19,14.26 v59.44,14.01 59.64,14.21 118.45,14.21 122.93,18.69 126.82,18.69 127.8,17.72 127.8,9.13 R3.2 | 44.2,14.25 35.11,14.25 v34.91,14.46 | 43.71,9.46 43.74,9.43 VREG.5 46.58,9.43 46.86,9.14 v46.86,8.38 | C17.1 133.44,7.62 C16.1 133.45,9.53 v134.75,9.53 | R3.2 131.46,5.44 131.44,5.46 | v146.45,5.46 146.45,5.48 147.68,6.71 147.68,9.14 | 147.7,15.62 C13.1 | 147.68,9.14 147.68,15.6 147.7,15.62 | PAM8304A.2 PAM8304A.3 147.14,21.52 147.7,20.95 147.7,15.62 | v10.54,40.28 11.88,40.28 12.3,39.85 14.33,39.85 v14.99,40.51 | R2.2 147.32,9.5 147.68,9.14 | R5.2 v32.28,44.7 | CP2104.7 38.84,6.4 C9.1 | CP2104.5 CP2104.6 CP2104.7 | CP2104.7 38.85,8.28 v39.61,8.28 | R12.1 R3.2 | R3.2 133.44,7.39 C17.1 | U2.8 U2.7 133.78,7.11 C17.1
D+
  Bottom 0.254: R29.2 40.68,4.17 40.68,10.25 40.39,10.54 CP2104.3
D-
  Bottom 0.254: CP2104.4 40.13,10.03 40.26,9.91 40.26,9.76 40.27,9.75 40.27,4.71 39.62,4.06 R28.2
DTR  (via drill 0.35)
  Top 0.254: v30.61,6.1 32.89,8.38 37.72,8.38 39.62,10.29 v39.62,13.19
  Bottom 0.254: R17.1 29.57,4.27 Q6.2 30.16,5.65 v30.61,6.1 | CP2104.23 38.35,12.3 38.35,12.95 38.59,13.19 v39.62,13.19
EN  (via drill 0.35)
  Top 0.254: v31.82,33.02 32.15,32.69 LCD.P$2
  Bottom 0.254: 29.08,45.72 29.08,46.8 C3.1 | 29.08,45.72 29.08,44.77 R5.1 29.02,43.48 31.51,41 31.51,33.33 v31.82,33.02 31.84,33 31.84,30.92 32.09,30.66 32.09,17.94 34.12,15.91 34.12,12.95 34.12,12.7 Q5.3 | ESP32.3 27.55,44.96 27.56,44.96 28.32,45.72 29.08,45.72
GATE
  Bottom 0.254: 4093DT.11 60.07,3.81 58.8,2.54 R30.1 Q3.1
GND  (via drill 0.35)
  Bottom 0.254: USB-C.S1 78.41,7.6 USB-C.A1 USB-C.B12 | USB-C.B1 USB-C.A12 71.59,7.6 USB-C.S2 | CP2104.2 37.86,11.04 37.59,10.77 CP2104.THERM | U2.11 138.78,7.11 U2.THERMAL 138.78,6.61 U2.15
  other vias: 26.42,2.29 4.82,8.62 28.19,24.38 22.1,11.43 21.46,21.84 30.86,14.86 30.3,17.55 30.34,21.11 13.21,40.77 28.24,39.91 143.06,8.07 15.59,1.82 14.77,4.15 8.02,4 38.84,25.52 37.27,31.07 11.93,29.68 14.28,25.15 10.1,23.82 143.26,13.97 129.85,13.79 13.59,42.93 32.38,42.42 126.87,14.48 121.67,15.75 124.08,8.76 129.29,21.46 3.81,46.35 16,24.89 11.94,27.18 20.01,13.53 121.92,23.5 40.51,11.94 52.2,11.56 129.98,10.87 67.18,7.75 61.21,8.51
  pour Top: 0,55.88 0,-0.13 151.38,-0.13 151.38,55.88
  pour Bottom: 0,55.88 0,-0.25 150.37,-0.25 150.37,55.88
IN+
  Bottom 0.254: R26.1 146.47,13.59 145.52,14.54 145.52,18.9 143.55,20.87 PAM8304A.5
IN-
  Bottom 0.254: R27.1 146.43,19.18 145.84,19.77 PAM8304A.4
IO0  (via drill 0.35)
  Top 0.254: v3.43,26.67 2.79,26.67 2.67,26.54 2.67,10.29 3.3,9.65 25.78,9.65 27.43,8 v27.43,7.62 | VOLUME.2 VOLUME.1 27.28,46.74 11.09,46.74 10.94,46.89 8.66,46.89 8.13,46.35 8.13,44.2 8.64,43.69 10.41,43.69 10.92,43.18 10.92,41.78 11.2,41.51 11.2,38.63 10.56,38 10.56,35.8 10.26,35.5 10.26,31.86 10.29,31.84 v10.29,31.11
  Bottom 0.254: R11.2 25.71,6.6 Q6.3 27.43,6.65 v27.43,7.62 | v3.43,26.67 4.32,26.67 4.63,26.98 R1.1 R4.1 ESP32.25 10.16,30.99 v10.29,31.11
IO2  (via drill 0.35)
  Top 0.254: v27.18,4.85 21.19,4.85 19.75,6.29 3.81,6.29 2.71,7.38 v2.71,7.87
  Bottom 0.254: R19.1 26.77,4.45 v27.18,4.85 | ESP32.24 5.91,29.72 5.56,29.37 5.56,28.09 5.4,27.93 5.22,27.93 5.04,27.75 5.04,26.82 4.24,26.01 2.76,26.01 | v2.71,7.87 2.69,7.9 2.69,21.06 2.7,21.07 2.7,25.95 2.76,26.01 | R1.2 2.73,26.04 2.76,26.01
IO4  (via drill 0.35)
  Top 0.254: v61.15,13.11 60.77,12.73 58.1,12.73 56.1,14.73 36.2,14.73 32,10.54 15.17,10.54 v13.77,11.94 | v3.37,16.64 4.64,17.91 5.46,17.91 11.05,23.5 11.05,32 v10.92,32.13 | v126.62,9.27 130.56,5.33 142.11,5.33 v143.07,6.29
  Bottom 0.254: v13.77,11.94 3.56,11.94 3.17,12.32 3.17,16.44 v3.37,16.64 | v10.92,32.13 8.47,32.13 ESP32.26 | v61.15,13.11 61.41,13.37 119.19,13.37 120.08,14.26 125.14,14.26 126.99,12.41 126.99,9.64 v126.62,9.27 | 140.05,6.1 U2.16 | U2.16 139.94,6.11 | U2.16 142.89,6.11 v143.07,6.29
IO5  (via drill 0.35)
  Top 0.254: v32.18,36.2 31.8,36.58 22.61,36.58 v21.46,35.43 | v33.9,31.2 34.81,30.29 LCD.P$5 | v10.16,39.37 9.91,39.12 v9.91,36.07
  Bottom 0.254: v33.9,31.2 33.7,31.4 33.7,34.08 32.18,35.6 v32.18,36.2 | ESP32.29 v9.91,36.07 | v10.16,39.37 14.61,39.37 14.99,38.99 14.99,36.07 15.62,35.43 v21.46,35.43
IO12  (via drill 0.35)
  Top 0.254: v32.5,31.19 32.4,31.09 v28.8,31.09 | v129.01,11.79 137.76,11.79 v141.47,8.08
  Bottom 0.254: ESP32.14 28.71,30.99 v28.8,31.09 | v32.5,31.19 32.5,18.11 35.91,14.7 118.36,14.7 122.77,19.1 126.99,19.1 128.21,17.89 128.21,12.59 v129.01,11.79 | v141.47,8.08 141.47,7.53 141.05,7.11 U2.14
IO13  (via drill 0.35)
  Top 0.254: MENU.2 MENU.1 23.75,39.62 v23.37,40.01
  Bottom 0.254: ESP32.16 24.25,28.45 23.28,29.43 23.28,34.46 23.37,34.55 v23.37,40.01
IO14  (via drill 0.35)
  Top 0.254: v24.13,31.88 v22.23,31.88
  Bottom 0.254: Q1.1 25.61,20.19 R24.2 23.94,28.19 22.87,29.26 22.87,31.23 v22.23,31.88 | ESP32.13 24.52,32.26 v24.13,31.88
IO15  (via drill 0.35)
  Top 0.254: v11.86,28.58 11.86,28.55 13.44,28.55 v13.57,28.42 | v60.3,13.46 60.17,13.34 58.27,13.34 56.37,15.24 33.78,15.24 v33.27,14.73 | v28.7,13.34 27.51,13.34 27.45,13.39 27.45,13.73 27.07,14.12 26.98,14.12 v25.21,15.89 | v126.62,8.26 130.3,4.57 v141.35,4.57
  Bottom 0.254: v13.57,28.42 13.57,17.8 13.92,17.45 20.72,17.45 21.63,16.53 23.16,16.53 23.8,15.89 v25.21,15.89 | v33.27,14.73 32.38,13.84 29.21,13.84 v28.7,13.34 | v60.3,13.46 60.62,13.78 119.03,13.78 119.91,14.66 125.31,14.66 127.39,12.58 127.39,9.03 v126.62,8.26 | v11.86,28.58 8.46,28.58 ESP32.23 | U2.1 139.28,4.73 139.45,4.57 v141.35,4.57
IO18  (via drill 0.35)
  Top 0.254: v21.08,34.04 21.54,33.58 27.4,33.58 28.69,32.28 38.44,32.28 38.83,31.89 LCD.P$3 | v15.88,29.08 15.88,29.46 16.26,29.84 17.65,29.84 17.92,29.58 17.92,28.91 18.29,28.54 v18.29,28.45 17.43,27.59 17.43,24.29 19.71,22.02 19.71,15.26 17.36,12.91 v16.98,12.91
  Bottom 0.254: SD_CARD.CLK 16.17,13.68 17.46,12.38 | 17.46,12.38 19.3,10.54 R21.1 | v21.08,34.04 19.18,34.04 18.29,33.15 v18.29,28.45 | ESP32.30 12.95,37.34 13.34,36.96 13.34,31.62 v15.88,29.08 | v16.98,12.91 17.46,12.42 17.46,12.38
IO19  (via drill 0.35)
  Top 0.254: v17.02,29.08 17.02,23.75 19.05,21.72 19.05,16.64 v18.8,16.38 | LCD.P$7 30.13,28.69 29.86,28.43 29.44,28.43 29.08,28.07 29.08,26.29 25.65,22.86 v22.86,22.86 | v18.16,27.05 v19.18,26.04
  Bottom 0.254: R22.1 19.43,12.57 18.37,13.63 SD_CARD.DAT0 18.37,15.96 v18.8,16.38 | v18.16,27.05 17.02,28.19 v17.02,29.08 14.1,32 14.1,38.1 13.58,38.61 ESP32.31 | v19.18,26.04 22.35,22.86 v22.86,22.86
IO21  (via drill 0.35)
  Top 0.254: LCD.P$4 38.96,31.09 38.17,31.88 28.52,31.88 27.26,33.15 21.21,33.15 20.67,32.61 v20.5,32.61
  Bottom 0.254: v20.5,32.61 21.26,32.61 22.66,34.01 22.66,40.46 21.46,41.66 11.56,41.66 11.05,41.15 ESP32.33
IO22  (via drill 0.35)
  Top 0.254: v12.19,31.11 12.19,32.67 11.91,32.95 11.91,40.78 12.19,41.06 12.19,44.45 11.68,44.96 v10.03,44.96
  Bottom 0.254: SD_CARD.CD/DAT3 12.87,30.44 v12.19,31.11 | v10.03,44.96 ESP32.36
IO23  (via drill 0.35)
  Top 0.254: v10.67,46.23 17.91,46.23 20.09,44.04 20.09,33.46 19.81,33.18 19.81,32.26 20.25,31.82 20.83,31.82 21.76,32.74 27.09,32.74 27.94,31.89 v27.94,30.29 28.1,30.45 28.51,30.45 28.53,30.43 29.07,30.43 29.09,30.45 33.52,30.45 34.48,29.49 LCD.P$6 | v22.48,15.88 22.5,15.85 24.15,15.85 24.76,16.46 24.76,18.73 24.77,18.74 24.77,19.18 25.65,20.07 v28.57,20.07
  Bottom 0.254: SD_CARD.CMD 13.97,16 15.01,17.04 20.55,17.04 21.72,15.88 v22.48,15.88 23.24,15.88 23.69,15.43 R20.1 | v10.67,46.23 ESP32.37 | v27.94,30.29 28.93,29.3 28.93,28.81 29.18,28.56 29.18,20.72 28.57,20.11 v28.57,20.07
IO25  (via drill 0.35)
  Top 0.254: v28.41,35 28.88,34.54 28.88,34.45 29.73,33.6 30.01,33.6 30.09,33.52 v30.44,33.52 | v31.03,27.81 34.55,27.81 v34.8,27.56
  Bottom 0.254: ESP32.10 27.93,36.07 28.19,35.81 28.19,35.22 v28.41,35 | v30.44,33.52 30.44,29.74 30.66,29.52 30.66,28.18 v31.03,27.81 | v34.8,27.56 34.8,27.07 35.44,26.43 35.44,25.89 35.19,25.64 35.19,18.92 36.97,17.14 117.36,17.14 122.18,21.96 122.38,22.16 125.36,25.15 143,25.15 143.51,24.64 143.51,22.1 142.93,21.52 PAM8304A.6 140.26,21.52 139.7,20.95 139.7,19.56 140.51,18.75 C12.2
IO26  (via drill 0.35)
  Top 0.254: v27.87,34.19 29.11,32.94 v29.74,32.94 | v30.25,27.3 31.39,26.16 v34.78,26.16 | v129.31,14.73 139.11,14.73 v139.53,14.31
  Bottom 0.254: ESP32.11 27.68,34.8 27.81,34.67 27.81,34.29 27.87,34.24 v27.87,34.19 | v29.74,32.94 29.74,29.87 30.25,29.36 v30.25,27.3 | v34.78,26.16 34.78,18.75 36.8,16.73 117.52,16.73 122.05,21.26 124.49,21.26 124.99,21.76 127.6,21.76 129.44,19.92 129.44,19.38 129.31,19.25 v129.31,14.73 | C11.2 140.51,15.28 v139.53,14.31
IO27  (via drill 0.35)
  Top 0.254: SELECT.2 SELECT.1 116.2,24.51 120.56,20.16 126.44,20.16 126.7,20.41 v127.05,20.41 | v33.16,36.2 32.39,35.43 v30.32,35.43
  Bottom 0.254: ESP32.12 29.4,33.53 30.32,34.46 v30.32,35.43 | v127.05,20.41 126.68,20.04 122.55,20.04 118.03,15.51 36.29,15.51 33.31,18.49 33.31,30.4 33.44,30.52 34.16,30.52 34.56,30.93 34.56,31.47 34.11,31.92 34.11,34.28 33.16,35.23 v33.16,36.2
IO32  (via drill 0.35)
  Top 0.254: v32.3,38.31 32.02,38.58 28.86,38.58 v28.84,38.61 | A.P$GND 121.37,25.1 120.78,24.51 120.78,21.59 121.27,21.1 v125.26,21.1
  Bottom 0.254: ESP32.8 v28.84,38.61 | v32.3,38.31 33.34,37.26 33.77,37.26 34.22,36.82 34.22,35.31 34.92,34.61 34.92,32.26 35.42,31.76 35.42,30.57 34.12,29.27 34.12,18.84 36.63,16.33 117.69,16.33 122.22,20.85 125.01,20.85 v125.26,21.1
IO33  (via drill 0.35)
  Top 0.254: v32.2,37.3 28.87,37.3 v28.84,37.34 | v126.17,20.82 127.58,22.23 129.29,22.23 133.6,26.54 133.6,28.57 134.53,29.5 B.P$GND
  Bottom 0.254: ESP32.9 v28.83,37.34 v28.84,37.34 | v32.2,37.3 32.64,36.86 33.43,36.86 33.81,36.47 33.81,35.93 33.77,35.88 33.77,35.19 34.51,34.45 34.51,32.09 35.02,31.59 35.02,30.81 33.72,29.51 33.72,18.66 36.46,15.92 117.86,15.92 122.38,20.44 125.8,20.44 v126.17,20.82
IO34  (via drill 0.35)
  Top 0.254: v6.76,21.89 6.43,21.89 6.22,22.1 6.22,22.73 4.09,24.87 4.09,27.14 4.08,27.15 4.08,29.84 | v10.16,42.16 8.74,40.74 8.74,33.25 8.53,33.05 5.99,33.05 4.08,31.13 4.08,29.84 | LEFT.P$ACTIVE 4.72,29.2 4.08,29.84
  Bottom 0.254: R8.2 R9.2 7.69,20.96 v6.76,21.89 | ESP32.6 22.54,41.15 21.63,42.06 10.26,42.06 v10.16,42.16
IO35  (via drill 0.35)
  Top 0.254: v11.86,23.93 11.86,25.96 12.32,26.42 v14.22,26.42 14.22,31.42 UP.P$ACTIVE | v24.26,34.92 23.95,34.62 v21.97,34.62
  Bottom 0.254: R7.1 3.62,20.07 | 3.62,20.07 R6.1 | 3.62,20.07 3.56,20.13 3.56,21.97 4.65,23.06 10.99,23.06 v11.86,23.93 | v14.22,26.42 17.87,26.42 17.89,26.39 18.43,26.39 18.95,26.91 18.95,33 19.29,33.35 21.34,33.35 21.97,33.98 v21.97,34.62 | ESP32.7 25.02,39.88 24.89,39.75 24.89,35.52 24.3,34.92 v24.26,34.92
IO36  (via drill 0.35)
  Top 0.254: v33.2,15.69 60.64,15.69 61.81,14.52 61.81,11.77 61.47,11.43 v60.45,11.43
  Bottom 0.254: R10.1 R32.2 58.76,11.43 v60.45,11.43 | ESP32.4 28.23,43.7 31.1,40.83 31.1,32.81 31.43,32.48 31.43,30.75 31.68,30.5 31.68,17.77 33.2,16.26 v33.2,15.69
IO39  (via drill 0.35)
  Top 0.254: v32.2,34.64 29.61,34.64 v29.53,34.72 | v128.24,18.87 128.24,11.92 126.55,10.23 125.09,8.77 | START.1 START.2 114.58,51.84 111.89,49.15 111.89,12.06 113.03,10.92 116.84,10.92 117.6,10.16 117.6,3.56 117.76,3.4 121.51,3.4 122.3,4.19 122.3,5.98 125.09,8.77 | v135.13,3.43 129.92,3.43 125.09,8.26 125.09,8.77
  Bottom 0.254: v128.24,18.87 127.48,19.63 122.72,19.63 118.2,15.11 36.11,15.11 32.9,18.31 32.9,30.56 33.16,30.82 33.16,33.69 v32.2,34.64 | v29.53,34.72 29.58,34.77 29.58,40.92 28.08,42.42 ESP32.5 | R12.2 134.38,2.68 v135.13,3.43
N$1  (via drill 0.35)
  Top 0.254: v62.47,12.19 62.97,12.7 v66.42,12.7
  Bottom 0.254: 48.06,10.99 C4.1 D2.C 51.88,12.94 58.87,12.94 59.61,12.19 v62.47,12.19 | 48.06,10.99 48.1,10.95 VREG.1 | 48.35,11.28 48.06,10.99 | Q4.2 66.74,12.38 v66.42,12.7
N$2  (via drill 0.35)
  Top 0.254: v11.27,19.48 10.92,19.83 10.92,22.23 11.81,23.11 v14.48,23.11 | v20.11,23.07 20.11,24.94 20.97,25.8 RIGHT.P$ACTIVE
  Bottom 0.254: R8.1 10.87,18.16 11.27,18.56 v11.27,19.48 | v20.11,23.07 20.07,23.11 v14.48,23.11
N$3
  Bottom 0.254: USB-C.A5 76.25,11.7 R15.1
N$4  (via drill 0.35)
  Top 0.254: v11.56,17.14 11.94,17.53 11.94,21.46 12.19,21.72 13.72,21.72 13.97,21.46 13.97,20.89 13.8,20.72 DOWN.P$ACTIVE
  Bottom 0.254: R6.2 5.52,16.45 5.97,16 11.05,16 11.56,16.51 v11.56,17.14
N$5  (via drill 0.35)
  Top 0.254: v20.57,18.8 23.88,22.1 26.54,22.1 v27.81,23.37
  Bottom 0.254: R23.2 21.21,18.16 v20.57,18.8 | v27.81,23.37 27.81,21.12 Q1.3
N$6  (via drill 0.35)
  Top 0.254: v20.57,3.05 20.57,1.84 LED.A
  Bottom 0.254: v20.57,3.05 22.29,3.05 R19.2
N$7
  Bottom 0.254: U2.2 138.78,4.34 139.32,3.81 141.73,3.81 144.53,6.61 R2.1
N$8
  Bottom 0.254: R33.1 46.15,5.18 47.17,6.21 49.2,6.21 50.23,5.18 SJ1.2
N$9  (via drill 0.35)
  Top 0.254: v33.91,2.41 33.91,3.3 34.42,3.81 69.44,3.81 70.13,4.49 73.18,4.49 v73.77,5.08
  Bottom 0.254: v73.77,5.08 74.25,5.56 USB-C.B6 74.25,8.59 74.42,8.76 75.06,8.76 75.25,8.57 USB-C.A6 | v33.91,2.41 34.29,2.03 R29.1
N$10  (via drill 0.35)
  Top 0.254: v35.05,3.05 36.7,1.4 67.61,1.4 70.3,4.08 73.94,4.08 v74.68,4.83
  Bottom 0.254: USB-C.A7 74.75,4.9 v74.68,4.83 75.75,5.9 USB-C.B7 | v35.05,3.05 35.05,3.68 35.43,4.06 R28.1
N$11
  Bottom 0.254: USB-C.B5 73.25,11.34 R16.1
N$12
  Bottom 0.254: 144.21,13.21 R26.2 144.15,13.21 143.09,13.21 142.41,13.89 C11.1
N$14  (via drill 0.35)
  Top 0.254: v131.95,19.3 131.44,19.3 130.34,20.41 127.98,20.41 127.32,19.75 124.4,19.75 123.03,18.39 123.03,11.4 v122.17,10.54
  Bottom 0.254: JACK.6 126.07,2.63 125.35,1.91 119.63,1.91 119.51,2.03 119.51,4.83 119.76,5.08 121.92,5.08 122.17,5.33 v122.17,10.54 | SPEAKER.2 133.13,18.13 v131.95,19.3
N$18  (via drill 0.35)
  Top 0.254: v30.35,18.67 35.58,23.89 LCD.P$13 | LCD.P$13 LCD.P$12 LCD.P$11 | LCD.P$14 LCD.P$13 | v30.35,22.1 29,22.1 28.09,21.19 26.4,21.19 26.25,21.34 24.89,21.34 24,20.45 v24,16.76
  Bottom 0.254: R23.1 23.94,16.83 v24,16.76 | v30.35,18.67 30.35,19.14 31,19.78 31,21.39 30.35,22.03 v30.35,22.1
N$19  (via drill 0.35)
  Top 0.254: 126.34,1.65 CHG_LED.C 141.99,1.78 143.89,3.68 v143.89,4.06
  Bottom 0.254: v143.89,4.06 143.89,3.15 143.42,2.68 R13.1
N$20
  Bottom 0.254: C12.1 R27.2
N$25
  Bottom 0.254: R17.2 32.02,4.4 Q5.1
N$26
  Bottom 0.254: R18.2 29.57,8.94 Q6.1
N$27  (via drill 0.35)
  Top 0.254: v83.95,10.03 116.2,10.03 116.59,9.65 116.59,3.64 117.23,2.99 123.47,2.99 123.77,2.7 139.16,2.7 v139.19,2.67
  Bottom 0.254: U$1.1 84.01,10.09 v83.95,10.03 | v139.19,2.67 140.49,2.67 R13.2
N$28
  Bottom 0.254: U$1.5 82.55,11.61 R14.1
N$56  (via drill 0.35)
  Top 0.254: v63.53,5.11 63.12,4.7 v55.12,4.7
  Bottom 0.254: 4093DT.10 62.09,3.16 62.23,3.3 62.23,4.19 61.98,4.45 60.97,4.45 | 60.97,4.45 4093DT.12 | 60.97,4.45 60.97,5.09 4093DT.13 v63.53,5.11 63.88,5.46 Q2.C | R31.1 41.86,2.21 42.16,1.91 50.67,1.91 53.47,4.7 v55.12,4.7
N$61  (via drill 0.35)
  Top 0.254: v49.4,5.08 54.57,5.08 55.26,5.77 62.03,5.77 v64.77,8.51
  Bottom 0.254: R33.2 49.3,5.18 v49.4,5.08 | Q2.B 64.77,9.89 v64.77,8.51
OUT
  Bottom 0.254: VREG.3 49.03,7.53 50.35,6.21 53.79,6.21 54.04,6.46 Q3.3
OUT+  (via drill 0.35)
  Top 0.254: v136.4,16.38 146.05,16.38 147.32,17.65 v147.32,22.48
  Bottom 0.254: U2.9 137.78,11.1 FB3.1 137.33,13.42 136.4,14.35 v136.4,16.38 | PAM8304A.1 146.98,22.82 v147.32,22.48
OUT-
  Bottom 0.254: 141.35,22.73 PAM8304A.8 | PAM8304A.8 141.31,22.82 | PAM8304A.8 139.79,22.82 138.75,21.78 138.75,11.75 138.94,11.56 FB4.1 138.28,9.34 U2.10
PWR_BUT_A
  Bottom 0.254: 4093DT.9 4093DT.8 60.37,1.27 57.02,1.27 56.84,1.46 R30.2 56.34,3.04 S1.1
PWR_BUT_B
  Bottom 0.254: S1.2 49.2,3.17 R31.2 C15.1
RTS
  Bottom 0.254: R18.1 31.81,7.76 Q5.2 32.02,7.22 33.59,5.65 34.48,5.65 35.05,6.22 35.05,7.49 34.67,7.87 34.67,11.64 35.39,12.36 36.27,12.36 CP2104.19
RXD  (via drill 0.35)
  Top 0.254: v37.49,13.44 37.49,9.32 36.96,8.79 31.4,8.79 28.2,5.59 21.34,5.59 v19.81,7.11
  Bottom 0.254: ESP32.34 6.86,42.42 6.6,42.16 6.6,38.1 6.6,34.67 5.59,33.66 2.41,33.66 1.8,33.05 1.8,7.47 2.67,6.6 19.3,6.6 v19.81,7.11 | CP2104.21 37.34,13.29 v37.49,13.44
SD_MODE
  Bottom 0.254: U2.4 133.47,5.36 R3.1
TXD  (via drill 0.35)
  Top 0.254: v36.2,13.46 35.5,13.46 29,6.96 22.46,6.96 v22.1,6.6
  Bottom 0.254: ESP32.35 6.99,43.69 6.2,42.9 6.2,34.84 5.42,34.06 2.25,34.06 1.4,33.21 1.4,7.3 2.5,6.2 12.7,6.2 21.69,6.2 v22.1,6.6 | v36.2,13.46 36.58,13.46 36.83,13.21 36.83,12.91 36.84,12.9 CP2104.20
VBAT  (via drill 0.35)
  Top 0.254: v83.69,7.24 83.69,8.8 81.98,10.52 71.12,10.52 | 69.96,10.52 71.12,10.52 | v55.2,10.62 67.27,10.62 v67.69,11.05 68.22,10.52 71.12,10.52
  Bottom 0.254: 54.55,11.28 v55.2,10.62 56.71,9.24 R10.2 | v83.69,7.24 83.69,7.87 84.01,8.19 U$1.3 | Q4.3 v67.69,11.05
  Bottom 0.406: BATTERY.2 85.51,6.45 C10.1 84.8,6.13 v83.69,7.24
VBUS  (via drill 0.35)  (1 unrouted)
  Top 0.254: CHG_LED.A 123.31,2.58 v82.76,2.58 | v35.71,7.62 47.48,7.62 v49.24,9.37 49.62,9.75 72.1,9.75 v72.48,9.37 80.93,9.37 v81.28,9.02
  Bottom 0.254: v49.24,9.37 49.17,9.43 | USB-C.A9 USB-C.B4 72.75,9.1 v72.48,9.37 69.32,9.37 Q4.1 | CP2104.8 38.34,7.61 38.1,7.37 35.96,7.37 v35.71,7.62 | C1.1 52.72,9.55 53.02,9.25 R25.1 | Q3.2 57.96,5.58 58.4,5.58 58.58,5.76 4093DT.14 60.96,7.37 60.39,7.94 54.38,7.94 C1.1 | v82.76,2.58 81.87,3.47 81.87,6.65 82.55,7.33 U$1.4 82.55,8.76 82.3,9.02 v81.28,9.02 77.6,9.02 77.25,8.67 USB-C.B9 77.28,7.62 77.55,7.62 USB-C.A4 | C1.1 53.02,10.38 D2.A
VO+  (via drill 0.35)
  Top 0.254: v123.69,13.26 123.44,13.51 123.44,18.22 124.57,19.34 127.49,19.34 127.79,19.65 v128.78,19.65
  Bottom 0.254: FB3.2 C19.1 133.39,12.83 128.91,12.83 128.65,13.08 128.65,18.35 128.9,18.6 128.9,19.53 v128.78,19.65 | JACK.5 128.54,5.93 127.53,6.94 123.44,6.94 123.06,7.32 123.06,11.41 JACK.3 123.26,12.83 v123.69,13.26
VO-  (via drill 0.35)
  Top 0.254: v146.71,6.86 146.71,12.17 145.56,13.31 142.98,13.31 142.96,13.34 v139.83,13.34 134.49,13.34 v134.37,13.21
  Bottom 0.254: C18.1 FB4.2 142.41,12.79 141.86,13.34 v139.83,13.34 | v146.71,6.86 145.44,5.59 145.44,5.08 145.44,4.17 144.65,3.39 144.65,2.41 143.51,1.27 122.94,1.27 122.3,0.64 122.21,0.73 JACK.1 | SPEAKER.1 135.13,13.97 v134.37,13.21

### Text on the board
bPlace: Board based on ODROID GO schematic | CHRG | board rev.F
tNames: CHRG LED